# Altium schematic sheet can_unisolated_lemo.SchDoc
size A4; Organization: UNSW Solar Racing Team; Address3: UNSW; Address4: Sydney NSW 2052; Address2: Electrical Engineering; Address1: Rm 109
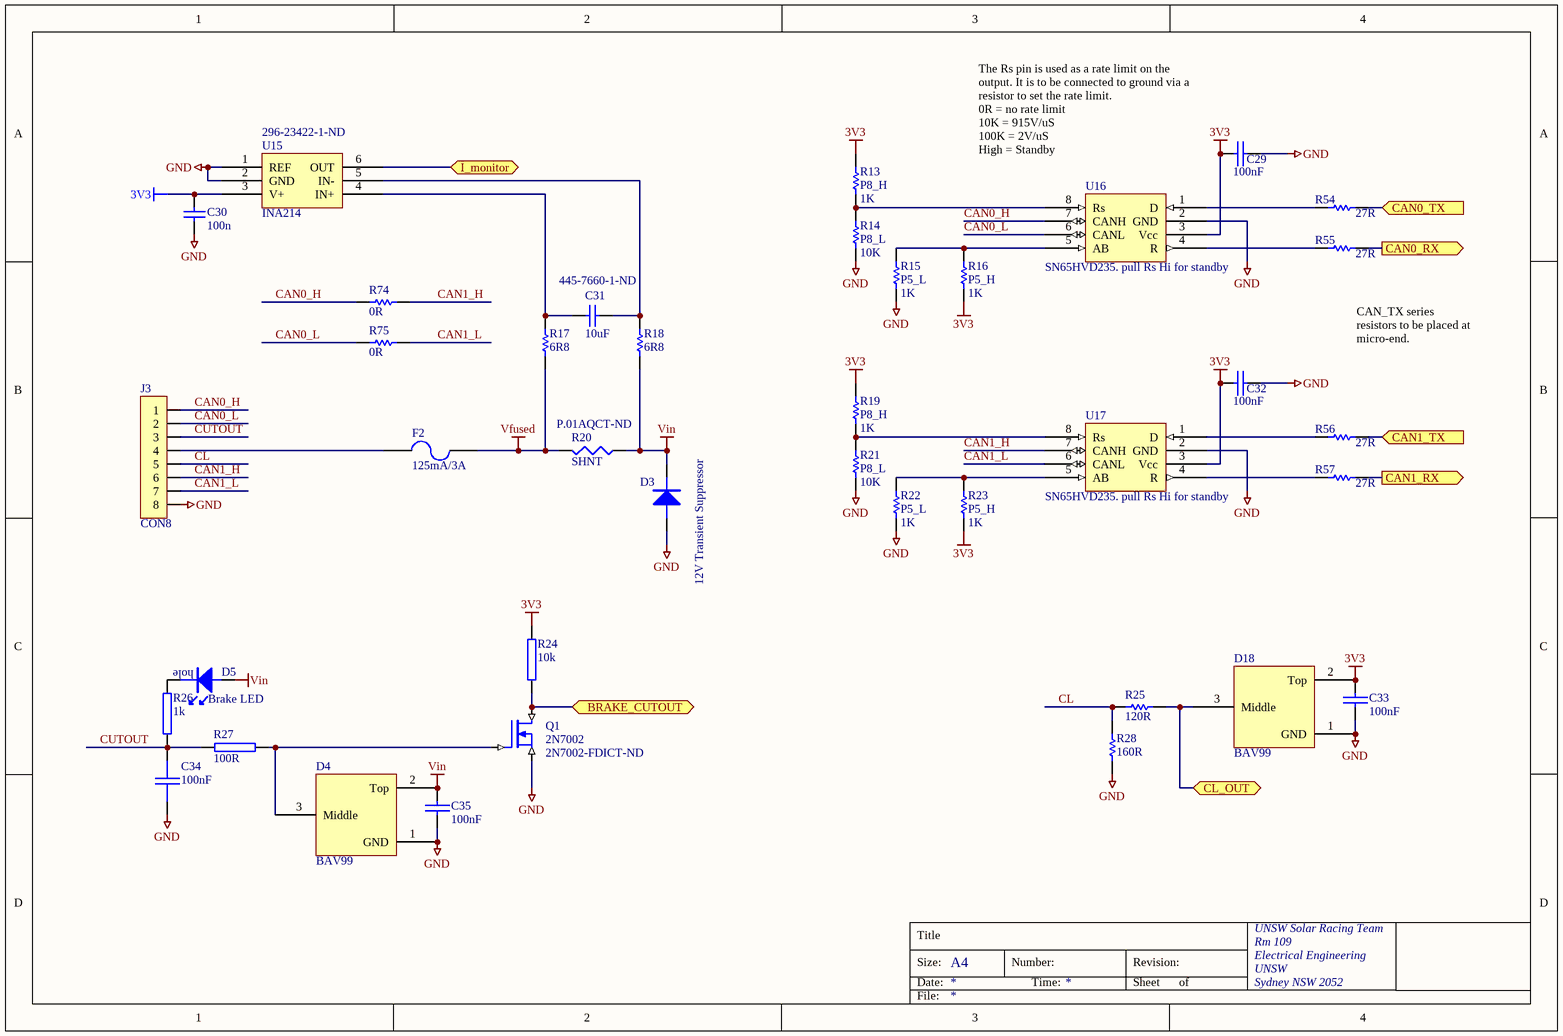
[diagram p0: can_unisolated_lemo.SchDoc]

## Parts
C29  100nF  [0603]
C30  100n  [0603]
C31  10uF  Supplier Part Number 1: 445-7660-1-ND  [0805]
C32  100nF  [0603]
C33  100nF  [0603]
C34  100nF  [0603]
C35  100nF  [0603]
D3  12V Transient Suppressor  [SMA]
D4  BAV99  [SOT23-3]
D5  Brake LED  [LED0.1]
D18  BAV99  [SOT23-3]
F2  125mA/3A  [LITTELFUSE-154]
J3  CON8  [LEMO_1B_308]
Q1  2N7002  Supplier Part Number 1: 2N7002-FDICT-ND  [SOT23-3]
R13  P8_H  value 1K  [0603]
R14  P8_L  value 10K  [0603]
R15  P5_L  value 1K  [0603]
R16  P5_H  value 1K  [0603]
R17  6R8  [0603]
R18  6R8  [0603]
R19  P8_H  value 1K  [0603]
R20  SHNT  Supplier Part Number 1: P.01AQCT-ND  [0805]
R21  P8_L  value 10K  [0603]
R22  P5_L  value 1K  [0603]
R23  P5_H  value 1K  [0603]
R24  10k  [0603]
R25  120R  [0603]
R26  1k  [0603]
R27  100R  [0603]
R28  160R  [0603]
R54  27R  [0603]
R55  27R  [0603]
R56  27R  [0603]
R57  27R  [0603]
R74  0R  [0603]
R75  0R  [0603]
U15  INA214  Supplier Part Number 1: 296-23422-1-ND  [SC70-6]
U16  SN65HVD235. pull Rs Hi for standby  [SO8]
U17  SN65HVD235. pull Rs Hi for standby  [SO8]

## Ports
BRAKE_CUTOUT, CAN0_RX (out), CAN0_TX (in), CAN1_RX (out), CAN1_TX (in), CL_OUT, I_monitor

## Nets
3V3: C29.2 C30.2 C32.2 C33.1 D18.2(Top) R13.2 R16.1 R19.2 R23.1 R24.2 U15.3(V+) U16.3(Vcc) U17.3(Vcc)
GND: C29.1 C30.1 C32.1 C33.2 C34.2 C35.2 D3.A D4.1(GND) D18.1(GND) J3.8 Q1.S R14.1 R15.1 R21.1 R22.1 R28.1 U15.1(REF) U15.2(GND) U16.2(GND) U17.2(GND)
Vfused: F2.2 R17.2 R20.2
Vin: C35.1 D3.K D4.2(Top) D5.A R18.2 R20.1
BRAKE_CUTOUT: Q1.D R24.1 ; port BRAKE_CUTOUT
CAN0_H: J3.1 R74.1 U16.7(CANH)
CAN0_L: J3.2 R75.1 U16.6(CANL)
CAN0_RX: R55.1 ; port CAN0_RX
CAN0_TX: R54.1 ; port CAN0_TX
CAN1_H: J3.6 R74.2 U17.7(CANH)
CAN1_L: J3.7 R75.2 U17.6(CANL)
CAN1_RX: R57.1 ; port CAN1_RX
CAN1_TX: R56.1 ; port CAN1_TX
CL: J3.5 R25.2 R28.2
CL_OUT: D18.3(Middle) R25.1 ; port CL_OUT
CUTOUT: C34.1 J3.3 R26.2 R27.1
I_monitor: U15.6(OUT) ; port I_monitor
NetC31_1: C31.1 R17.1 U15.4(IN+)
NetC31_2: C31.2 R18.1 U15.5(IN-)
NetD4_3: D4.3(Middle) Q1.G R27.2
NetD5_K: D5.K R26.1
NetF2_1: F2.1 J3.4
NetR13_1: R13.1 R14.2 U16.8(Rs)
NetR15_2: R15.2 R16.2 U16.5(AB)
NetR19_1: R19.1 R21.2 U17.8(Rs)
NetR22_2: R22.2 R23.2 U17.5(AB)
NetR54_2: R54.2 U16.1(D)
NetR55_2: R55.2 U16.4(R)
NetR56_2: R56.2 U17.1(D)
NetR57_2: R57.2 U17.4(R)

## Notes on the sheet
- The Rs pin is used as a rate limit on the output. It is to be connected to ground via a resistor to set the rate limit.
  0R = no rate limit
  10K = 915V/uS
  100K = 2V/uS
  High = Standby
- CAN_TX series resistors to be placed at micro-end.
- Title
- Size:
- Date:
- A4
- Number:
- Time:
- Revision:
- Sheet
- of
- File:
- (in symbol LED_HOLE) hole

## Library data of the parts
C29 C32 C33 C35 = CAP: Capacitor; Farnell: 753-567; Price: 0.31
C30 = Cap Semi: Capacitor (Semiconductor SIM Model); Value: 100nF; Published: 8-Jun-2000; LatestRevisionDate: 17-Jul-2002; LatestRevisionNote: Re-released for DXP Platform.; PackageReference: C1206; Publisher: Altium Limited; Element14: 9406140; Element14 Price: 0.13
C31 = Cap Semi: Capacitor (Semiconductor SIM Model); Manufacturer: TDK Corporation; Manufacturer Part Number: C2012X5R1A106K125AB; Description: CAP CER 10UF 10V 10% X5R 0805; Capacitance: 10µF; Voltage - Rated: 10V; Tolerance: ±10%; Temperature Coefficient: X5R; Value: 10uF; Element14: 1458902RL; Element14 Price: 0.69; Supplier 1: Digi-Key; RoHS: RoHS Compliant; Category: Capacitors; Stock 1: 260840; Pricing 1: 1=0.24, 10=0.163, 100=0.0833, 250=0.06744, 500=0.05948, 1000=0.05057 (AUD); Packaging: Cut Tape (CT); Mounting Type: Surface Mount, MLCC; Operating Temperature: -55°C ~ 85°C; Applications: General Purpose; Ratings: -; Package / Case: 0805 (2012 Metric); Size / Dimension: 0.079" L x 0.049" W (2.00mm x 1.25mm); Height - Seated (Max): -; Thickness (Max): 0.057" (1.45mm); Lead Spacing: -; Features: -; Lead Style: -; ComponentLink1URL: http://product.tdk.com/capacitor/mlcc/en/documents/mlcc_commercial_general_en.pdf; ComponentLink1Description: http://product.tdk.com/capacitor/mlcc/en/documents/mlcc_commercial_general_en.pdf
C34 = CAP: Capacitor; Value: 0.1uF; Revision: July-2002: Re-released for DXP Platform.; Farnell: 753-567; Price: 0.31
D3 = DIODE: Farnell: 302-3096; Price: 1.25
D4 D18 = BAV99: Dual Diode
D5 = LED_HOLE: through hole LED
F2 = FUSE2: Fuse; Farnell: 664-893; Other Info: www.littelfuse.com; Price: 5.67
J3 = CON8: Connector
Q1 = N-MOSFET: pin to pad: D>3 G>1 S>2; Manufacturer: Diodes Inc; Manufacturer Part Number: 2N7002-7-F; Description: MOSFET N-CH 60V 115MA SOT23-3; FET Type: MOSFET N-Channel, Metal Oxide; FET Feature: Standard; Drain to Source Voltage (Vdss): 60V; Current - Continuous Drain (Id) @ 25° C: 115mA (Ta); Rds On (Max) @ Id, Vgs: 7.5 Ohm @ 50mA, 5V; Vgs(th) (Max) @ Id: 2.5V @ 250µA; Input Capacitance (Ciss) @ Vds: 50pF @ 25V; Power - Max: 300mW; Farnell: 518-402; Price: 0.62; Supplier 1: Digi-Key; RoHS: RoHS Compliant; Category: Discrete Semiconductor Products; Stock 1: 120849; Pricing 1: 1=0.18, 10=0.171, 25=0.1548, 100=0.1114, 250=0.0656, 500=0.05444, 1000=0.03714 (AUD); Packaging: Cut Tape (CT); Gate Charge (Qg) @ Vgs: -; Mounting Type: Surface Mount; Package / Case: TO-236-3, SC-59, SOT-23-3; Supplier Device Package: SOT-23-3; ComponentLink1URL: http://www.diodes.com/datasheets/ds11303.pdf; ComponentLink1Description: http://www.diodes.com/datasheets/ds11303.pdf
R13-R16 R19 R21-R23 = Res Semi: Semiconductor Resistor; Published: 8-Jun-2000; LatestRevisionDate: 17-Jul-2002; LatestRevisionNote: Re-released for DXP Platform.; PackageReference: AXIAL-0.5; Publisher: Altium Limited; PackageDescription: Axial Device, Thru-Hole; 2 Leads; 0.5 in Pin Spacing
R17 R18 = Res Semi: Semiconductor Resistor; Manufacturer: Panasonic Electronic Components; Manufacturer Part Number: ERJ-3GEYJ6R8V; Description: RES 6.8 OHM 1/10W 5% 0603 SMD; Resistance (Ohms): 6.8; Power (Watts): 0.1W, 1/10W; Temperature Coefficient: -100/ +600ppm/°C; Tolerance: ±5%; Published: 8-Jun-2000; LatestRevisionDate: 17-Jul-2002; LatestRevisionNote: Re-released for DXP Platform.; PackageReference: AXIAL-0.5; Publisher: Altium Limited; Value: 6R8; Element14: 9331492RL; Element14 Price: 0.08 (min order 50); Supplier 1: Digi-Key; Supplier Part Number 1: P6.8GCT-ND; RoHS: RoHS Compliant; Category: Resistors; Stock 1: 133530; Pricing 1: 1=0.12, 50=0.011, 100=0.0084, 250=0.00624, 500=0.00462, 1000=0.00308 (AUD); Packaging: Cut Tape (CT); Composition: Thick Film; Features: -; Package / Case: 0603 (1608 Metric); Supplier Device Package: 0603; Size / Dimension: 0.063" L x 0.031" W (1.60mm x 0.80mm); Height: 0.022" (0.55mm); Number of Terminations: 2; ComponentLink1URL: http://industrial.panasonic.com/www-cgi/jvcr13pz.cgi?E+PZ+3+AOA0001+ERJ3GEYJ6R8V+7+WW; ComponentLink1Description: http://industrial.panasonic.com/www-cgi/jvcr13pz.cgi?E+PZ+3+AOA0001+ERJ3GEYJ6R8V+7+WW
R20 = Res3: Resistor; Manufacturer: Panasonic Electronic Components; Manufacturer Part Number: ERJ-6BWFR010V; Description: RES 0.01 OHM 1/2W 1% 0805 SMD; Resistance (Ohms): 0.01; Power (Watts): 0.5W, 1/2W; Temperature Coefficient: ±300ppm/°C; Tolerance: ±1%; Publisher: Altium Limited; Element14: 8067520; Element14 Price: 0.62; Supplier 1: Digi-Key; RoHS: RoHS Compliant; Category: Resistors; Stock 1: 6983; Pricing 1: 1=1.38, 50=0.7394, 100=0.6469, 250=0.573, 500=0.48058, 1000=0.36967 (AUD); Packaging: Cut Tape (CT); Composition: Thick Film; Features: -; Package / Case: 0805 (2012 Metric); Supplier Device Package: 0805; Size / Dimension: 0.079" L x 0.049" W (2.00mm x 1.25mm); Height: 0.030" (0.75mm); Number of Terminations: 2; ComponentLink1URL: http://industrial.panasonic.com/www-data/pdf/AOA0000/AOA0000CE3.pdf; ComponentLink1Description: http://industrial.panasonic.com/www-data/pdf/AOA0000/AOA0000CE3.pdf
R24 = RES: Standard Resistor; Farnell: 612-601; Price: 0.11; Value: 10k
R25 = Res Semi: Semiconductor Resistor; Manufacturer: Panasonic Electronic Components; Manufacturer Part Number: ERJ-3EKF1200V; Value: 6R8; Description: RES 120 OHM 1/10W 1% 0603 SMD; Resistance (Ohms): 120; Power (Watts): 0.1W, 1/10W; Temperature Coefficient: ±100ppm/°C; Tolerance: ±1%; Published: 8-Jun-2000; LatestRevisionDate: 17-Jul-2002; LatestRevisionNote: Re-released for DXP Platform.; PackageReference: AXIAL-0.5; Publisher: Altium Limited; Element14: 9331492RL; Element14 Price: 0.08 (min order 50); Supplier 1: Digi-Key; Supplier Part Number 1: P120HCT-ND; RoHS: RoHS Compliant; Category: Resistors; Stock 1: 359454; Pricing 1: 1=0.12, 50=0.0166, 100=0.0126, 250=0.00936, 500=0.00692, 1000=0.00461 (AUD); Packaging: Cut Tape (CT); Composition: Thick Film; Features: -; Package / Case: 0603 (1608 Metric); Supplier Device Package: 0603; Size / Dimension: 0.063" L x 0.031" W (1.60mm x 0.80mm); Height: 0.022" (0.55mm); Number of Terminations: 2; ComponentLink1URL: http://industrial.panasonic.com/www-cgi/jvcr13pz.cgi?E+PZ+3+AOA0002+ERJ3EKF1200V+7+WW; ComponentLink1Description: http://industrial.panasonic.com/www-cgi/jvcr13pz.cgi?E+PZ+3+AOA0002+ERJ3EKF1200V+7+WW
R26 R27 = RES: Standard Resistor; Value: 10k; Farnell: 612-601; Price: 0.11
R28 = Res Semi: Semiconductor Resistor; Manufacturer: Panasonic Electronic Components; Manufacturer Part Number: ERJ-2RKF1600X; Value: 6R8; Description: RES 160 OHM 1/10W 1% 0402 SMD; Resistance (Ohms): 160; Power (Watts): 0.1W, 1/10W; Temperature Coefficient: ±100ppm/°C; Tolerance: ±1%; Published: 8-Jun-2000; LatestRevisionDate: 17-Jul-2002; LatestRevisionNote: Re-released for DXP Platform.; PackageReference: AXIAL-0.5; Publisher: Altium Limited; Element14: 9331492RL; Element14 Price: 0.08 (min order 50); Supplier 1: Digi-Key; Supplier Part Number 1: P160LCT-ND; RoHS: RoHS Compliant; Category: Resistors; Stock 1: 47882; Pricing 1: 1=0.12, 50=0.029, 100=0.0221, 250=0.0164, 500=0.01212, 1000=0.00808, 5000=0.00568 (AUD); Packaging: Cut Tape (CT); Composition: Thick Film; Features: -; Package / Case: 0402 (1005 Metric); Supplier Device Package: 0402; Size / Dimension: 0.039" L x 0.020" W (1.00mm x 0.50mm); Height: 0.016" (0.40mm); Number of Terminations: 2; ComponentLink1URL: http://industrial.panasonic.com/www-cgi/jvcr13pz.cgi?E+PZ+3+AOA0002+ERJ2RKF1600X+7+WW; ComponentLink1Description: http://industrial.panasonic.com/www-cgi/jvcr13pz.cgi?E+PZ+3+AOA0002+ERJ2RKF1600X+7+WW
R54-R57 = Res Semi: Semiconductor Resistor; Manufacturer: Panasonic Electronic Components; Manufacturer Part Number: ERJ-3EKF27R0V; Value: 1K; Description: RES 27 OHM 1/10W 1% 0603 SMD; Resistance (Ohms): 27; Power (Watts): 0.1W, 1/10W; Temperature Coefficient: ±100ppm/°C; Tolerance: ±1%; Published: 8-Jun-2000; LatestRevisionDate: 17-Jul-2002; LatestRevisionNote: Re-released for DXP Platform.; PackageReference: AXIAL-0.5; Publisher: Altium Limited; PackageDescription: Axial Device, Thru-Hole; 2 Leads; 0.5 in Pin Spacing; Supplier 1: Digi-Key; Supplier Part Number 1: P27.0HCT-ND; RoHS: RoHS Compliant; Category: Resistors; Stock 1: 89523; Pricing 1: 1=0.12, 50=0.0166, 100=0.0126, 250=0.00936, 500=0.00692, 1000=0.00461 (AUD); Packaging: Cut Tape (CT); Composition: Thick Film; Features: -; Package / Case: 0603 (1608 Metric); Supplier Device Package: 0603; Size / Dimension: 0.063" L x 0.031" W (1.60mm x 0.80mm); Height: 0.022" (0.55mm); Number of Terminations: 2; ComponentLink1URL: http://industrial.panasonic.com/www-cgi/jvcr13pz.cgi?E+PZ+3+AOA0002+ERJ3EKF27R0V+7+WW; ComponentLink1Description: http://industrial.panasonic.com/www-cgi/jvcr13pz.cgi?E+PZ+3+AOA0002+ERJ3EKF27R0V+7+WW
R74 R75 = Res Semi: Semiconductor Resistor; Value: 6R8; Published: 8-Jun-2000; LatestRevisionDate: 17-Jul-2002; LatestRevisionNote: Re-released for DXP Platform.; PackageReference: AXIAL-0.5; Publisher: Altium Limited; Element14: 9331492RL; Element14 Price: 0.08 (min order 50)
U15 = INA214: Current Shunt Monitor; Manufacturer: Texas Instruments; Manufacturer Part Number: INA214AIDCKT; Description: IC CURRENT MONITOR 1% SC70-6; Function: Current Monitor; Sensing Method: High/Low-Side; Accuracy: ±1%; Voltage - Input: 2.7 V ~ 26 V; Element14: 1754262; Element14 Price: $4.22; Supplier 1: Digi-Key; RoHS: RoHS Compliant; Category: Integrated Circuits (ICs); Stock 1: 2023; Pricing 1: 1=2.58, 10=2.336, 25=2.0932, 100=1.0952 (AUD); Packaging: Cut Tape (CT); Current - Output: -; Operating Temperature: -40°C ~ 125°C; Mounting Type: Surface Mount; Package / Case: 6-TSSOP, SC-88, SOT-363; Supplier Device Package: SC-70-6; ComponentLink1URL: http://www.ti.com/lit/ds/symlink/ina210.pdf; ComponentLink1Description: http://www.ti.com/lit/ds/symlink/ina210.pdf
U16 U17 = SN65HVD235: 3.3V CAN XCVR W/STANDBY